# Altium schematic sheet ee453_pcb_Schulz.SchDoc: EE 453 Capstone
size B; ApprovedBy: Your Name; CheckedBy: Your Name; Author: Your Name; CompanyName: Dept. of Elec. and Comp. Engg.; DrawnBy: Your Name; Engineer: Your Nmae; Organization: UW-Seattle; Address1: 185 Stevens Way; Address2: Paul Allen Center; Address3: Seattle, WA; Address4: US-98195; DocumentNumber: 1; Revision: 1.0; SheetNumber: 1; SheetTotal: 1
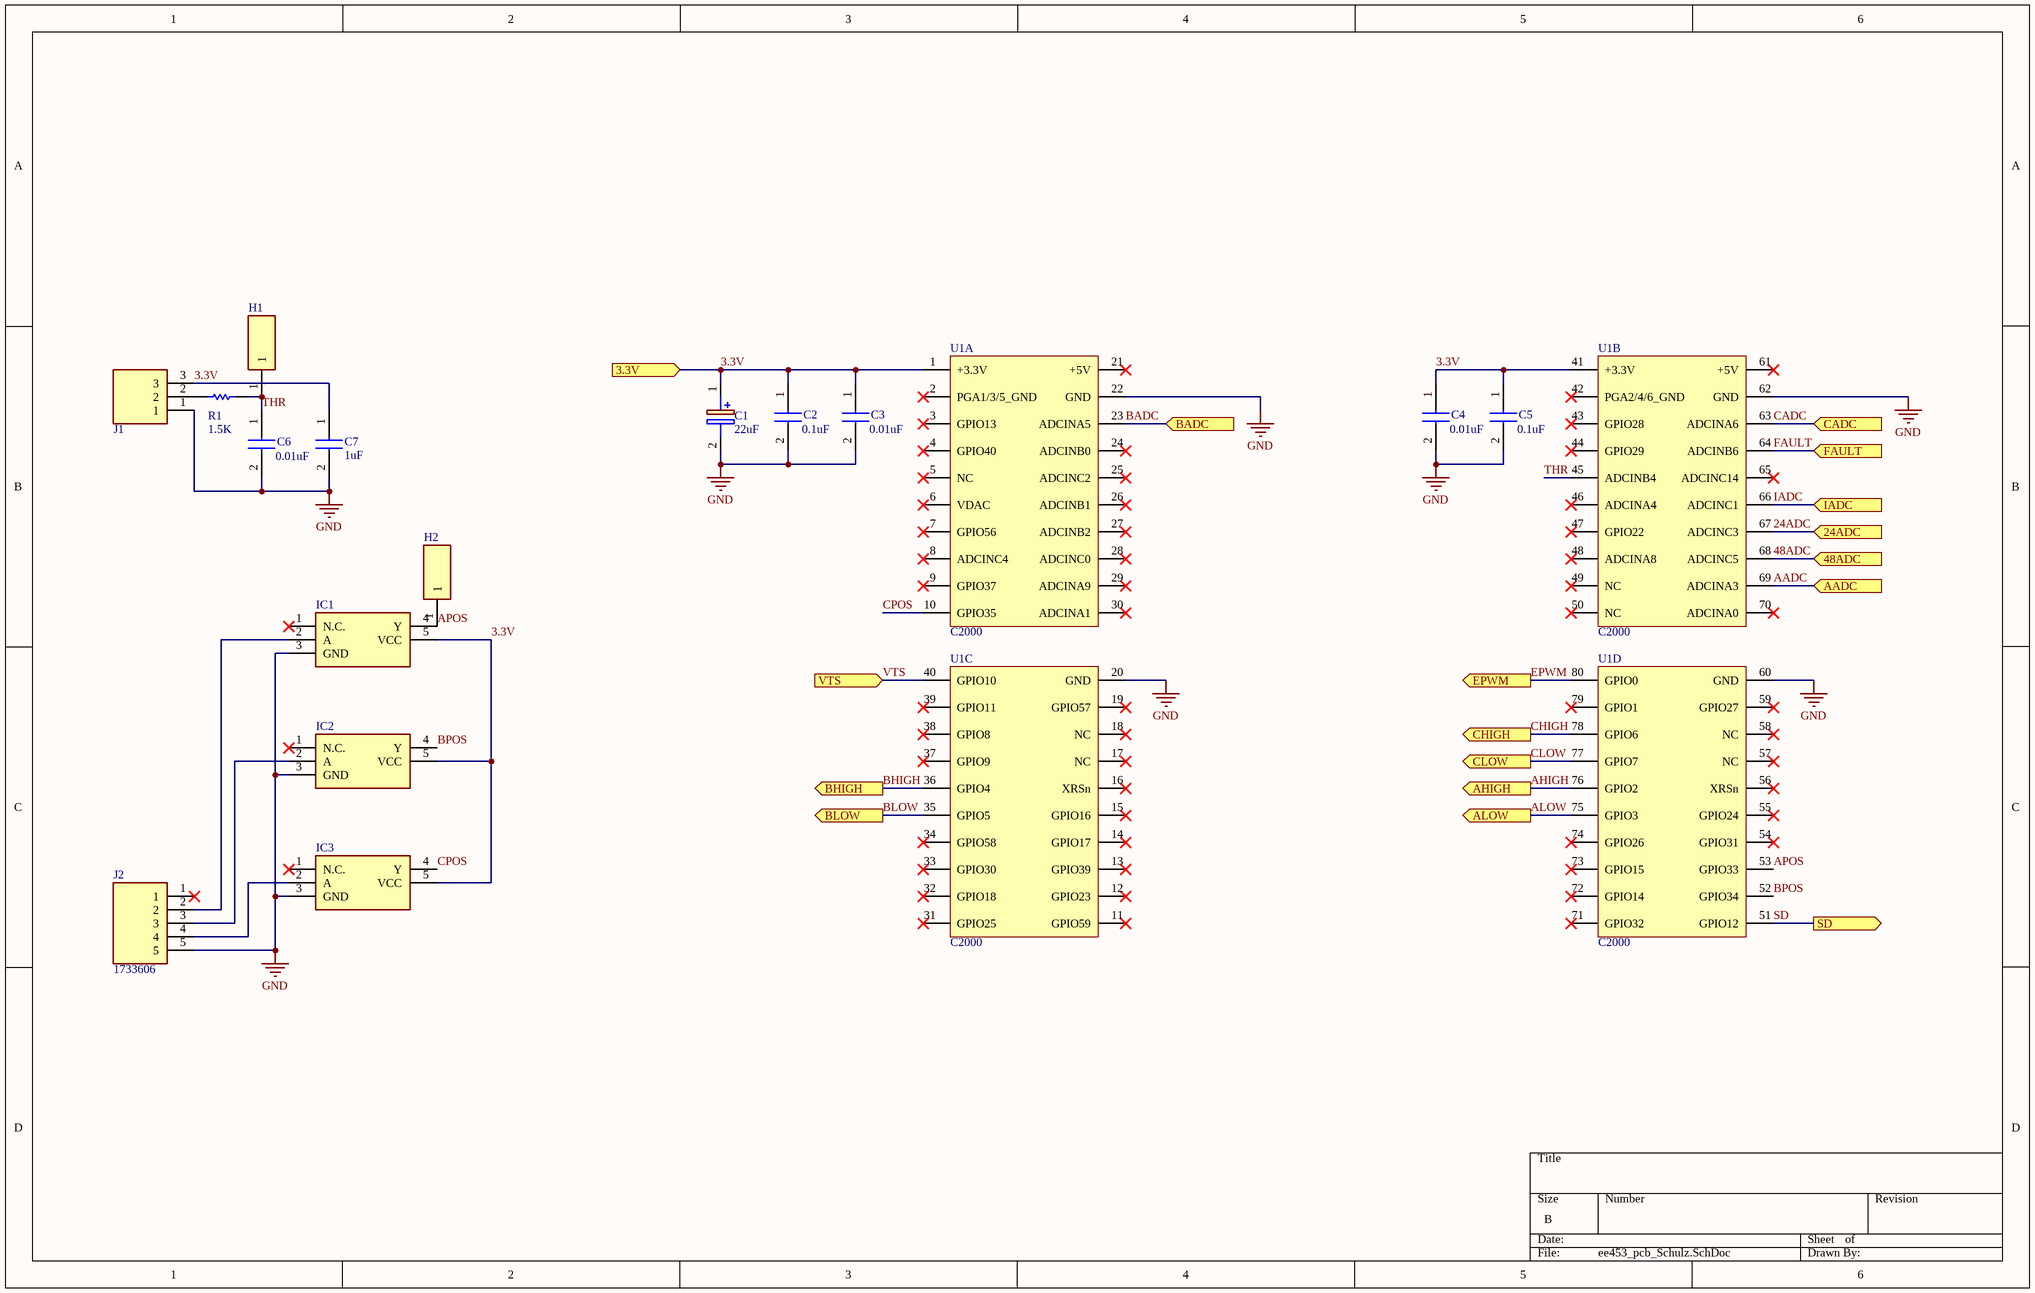
[diagram p0: ee453_pcb_Schulz.SchDoc]

## Parts
C1  value 22uF  [CAPPRD250W50D800H800]  (hidden comment: ECE-A1AKA220I)
C2  value 0.1uF  [CAPC1005X55N]  (hidden comment: CC0402KRX7R6BB104)
C3  value 0.01uF  [CAPC0603X33N]  (hidden comment: GRM033R71A103KA01D)
C4  value 0.01uF  [CAPC0603X33N]  (hidden comment: GRM033R71A103KA01D)
C5  value 0.1uF  [CAPC1005X55N]  (hidden comment: CC0402KRX7R6BB104)
C6  value 0.01uF  [C315C103K5R5TA7990]  (hidden comment: C315C103K5R5TA7990)
C7  value 1uF  [C330C105K5R5TA]  (hidden comment: C330C105K5R5TA)
H1  5003  [5003]  (value not drawn)
H2  5003  [5003]  (value not drawn)
IC1  SN74LV1T34DBVRG4  [SOT95P280X145-5N]  (value not drawn)
IC2  SN74LV1T34DBVRG4  [SOT95P280X145-5N]  (value not drawn)
IC3  SN74LV1T34DBVRG4  [SOT95P280X145-5N]  (value not drawn)
J1  1985917  [1985917]  (value not drawn)
J2  1733606  [SHDR5W110P0X500_1X5_2532X7360X1530P]
R1  value 1.5K  [AXIAL-0.3]  (hidden comment: Res1)
U1  C2000  [C2000]  (parts A,B,C,D of 4)

## Ports
3.3V (in), 24ADC (in), 48ADC (in), AADC (in), AHIGH (out), ALOW (out), BADC (in), BHIGH (out), BLOW (out), CADC (in), CHIGH (out), CLOW (out), EPWM (out), FAULT (in), IADC (in), SD (out), VTS (in)

## Nets
GND: C1.2(-) C2.2 C3.2 C4.2 C5.2 C6.2 C7.2 IC1.3(GND) IC2.3(GND) IC3.3(GND) J1.1 J2.5 U1.20(GND) U1.22(GND) U1.60(GND) U1.62(GND)
3.3V: C1.1(+) C2.1 C3.1 C4.1 C5.1 C7.1 IC1.5(VCC) IC2.5(VCC) IC3.5(VCC) J1.3 U1.1(+3.3V) U1.41(+3.3V) ; port 3.3V
24ADC: U1.67(ADCINC3) ; port 24ADC
48ADC: U1.68(ADCINC5) ; port 48ADC
AADC: U1.69(ADCINA3) ; port AADC
AHIGH: U1.76(GPIO2) ; port AHIGH
ALOW: U1.75(GPIO3) ; port ALOW
APOS: H2.1 IC1.4(Y) U1.53(GPIO33)
BADC: U1.23(ADCINA5) ; port BADC
BHIGH: U1.36(GPIO4) ; port BHIGH
BLOW: U1.35(GPIO5) ; port BLOW
BPOS: IC2.4(Y) U1.52(GPIO34)
CADC: U1.63(ADCINA6) ; port CADC
CHIGH: U1.78(GPIO6) ; port CHIGH
CLOW: U1.77(GPIO7) ; port CLOW
CPOS: IC3.4(Y) U1.10(GPIO35)
EPWM: U1.80(GPIO0) ; port EPWM
FAULT: U1.64(ADCINB6) ; port FAULT
IADC: U1.66(ADCINC1) ; port IADC
SD: U1.51(GPIO12) ; port SD
THR: C6.1 H1.1 R1.1 U1.45(ADCINB4)
VTS: U1.40(GPIO10) ; port VTS
NetIC1_2: IC1.2(A) J2.2
NetIC2_2: IC2.2(A) J2.3
NetIC3_2: IC3.2(A) J2.4
NetJ1_2: J1.2 R1.2

Not connected (* = marked no-connect by the designer): IC1 1(N.C.)*; IC2 1(N.C.)*; IC3 1(N.C.)*; J2 1*; U1 2(PGA1/3/5_GND)* 3(GPIO13)* 4(GPIO40)* 5(NC)* 6(VDAC)* 7(GPIO56)* 8(ADCINC4)* 9(GPIO37)* 11(GPIO59)* 12(GPIO23)* 13(GPIO39)* 14(GPIO17)* 15(GPIO16)* 16(XRSn)* 17(NC)* 18(NC)* 19(GPIO57)* 21(+5V)* 24(ADCINB0)* 25(ADCINC2)* 26(ADCINB1)* 27(ADCINB2)* 28(ADCINC0)* 29(ADCINA9)* 30(ADCINA1)* 31(GPIO25)* 32(GPIO18)* 33(GPIO30)* 34(GPIO58)* 37(GPIO9)* 38(GPIO8)* 39(GPIO11)* 42(PGA2/4/6_GND)* 43(GPIO28)* 44(GPIO29)* 46(ADCINA4)* 47(GPIO22)* 48(ADCINA8)* 49(NC)* 50(NC)* 54(GPIO31)* 55(GPIO24)* 56(XRSn)* 57(NC)* 58(NC)* 59(GPIO27)* 61(+5V)* 65(ADCINC14)* 70(ADCINA0)* 71(GPIO32)* 72(GPIO14)* 73(GPIO15)* 74(GPIO26)* 79(GPIO1)*

## Notes on the sheet
- Title
- Size:
- Date:
- B
- Number:
- Time:
- Revision:
- Sheet
- of
- File:

## Library data of the parts
C1 = ECE-A1AKA220I: Capacitor Polarised 10V; Manufacturer_Name: Panasonic; Datasheet Link: https://componentsearchengine.com/Datasheets/1/ECE-A1AKA220I.pdf; Height: 8mm; Manufacturer_Part_Number: ECE-A1AKA220I; Mouser Part Number: 667-ECE-A1AKA220I; Mouser Price/Stock: https://www.mouser.com/Search/Refine.aspx?Keyword=667-ECE-A1AKA220I
C2 C5 = CC0402KRX7R6BB104: Capacitor 10V; Manufacturer_Name: YAGEO (PHYCOMP); Datasheet Link: https://www.mouser.com/datasheet/2/447/UPY-GPHC_X7R_6.3V-to-50V_18-1154002.pdf; Height: 0.55mm; Manufacturer_Part_Number: CC0402KRX7R6BB104; Mouser Part Number: 603-CC402KRX7R6BB104; Mouser Price/Stock: https://www.mouser.com/Search/Refine.aspx?Keyword=603-CC402KRX7R6BB104; RS Part Number: 6698690; RS Price/Stock: http://uk.rs-online.com/web/p/products/6698690
C3 C4 = GRM033R71A103KA01D: Capacitor 10V; Manufacturer_Name: Murata Electronics; Datasheet Link: https://psearch.en.murata.com/capacitor/product/GRM033R71A103KA01%23.html; Height: 0.33mm; Manufacturer_Part_Number: GRM033R71A103KA01D; Mouser Part Number: 81-GRM033R71A103KA1D; Mouser Price/Stock: https://www.mouser.com/Search/Refine.aspx?Keyword=81-GRM033R71A103KA1D; RS Part Number: 7235143P; RS Price/Stock: http://uk.rs-online.com/web/p/products/7235143P
C6 = C315C103K5R5TA7990: Capacitor 50V; Manufacturer_Name: Kemet; Datasheet Link: https://api.kemet.com/component-edge/download/datasheet/C315C103K5R5TA.pdf; Height: 4.66mm; Manufacturer_Part_Number: C315C103K5R5TA7990; Mouser Part Number: N/A; Mouser Price/Stock: https://www.mouser.com/Search/Refine.aspx?Keyword=N%2FA
C7 = C330C105K5R5TA: Capacitor 50V; Manufacturer_Name: Kemet; Datasheet Link: http://uk.rs-online.com/web/p/products/8704038; Height: 9mm; Manufacturer_Part_Number: C330C105K5R5TA; Mouser Part Number: 80-C330C105K5R; Mouser Price/Stock: https://www.mouser.com/Search/Refine.aspx?Keyword=80-C330C105K5R; RS Part Number: 8704038; RS Price/Stock: http://uk.rs-online.com/web/p/products/8704038
H1 H2 = 5003: Hardware; Manufacturer_Name: Keystone Electronics; Allied_Number: 70799414; Datasheet Link: https://componentsearchengine.com/Datasheets/1/5003.pdf; Height: 4.57mm; Manufacturer_Part_Number: 5003; Mouser Part Number: 534-5003; Mouser Price/Stock: https://www.mouser.com/Search/Refine.aspx?Keyword=534-5003; Allied Price/Stock: https://www.alliedelec.com/keystoneelectronics-5003/70799414/
IC1-IC3 = SN74LV1T34DBVRG4: Integrated Circuit; Manufacturer_Name: Texas Instruments; Datasheet Link: http://www.ti.com/lit/gpn/sn74lv1t34; Height: 1.45mm; Manufacturer_Part_Number: SN74LV1T34DBVRG4; Mouser Part Number: 595-SN74LV1T34DBVRG4; Mouser Price/Stock: https://www.mouser.com/Search/Refine.aspx?Keyword=595-SN74LV1T34DBVRG4
J1 = 1985917: Connector; Manufacturer_Name: Phoenix Contact; Allied_Number: 70353658; Datasheet Link: https://media.digikey.com/pdf/Data%20Sheets/Phoenix%20Contact%20PDFs/Multi-Postion%20PCTerminal%20Blocks.pdf; Height: 13.95mm; Manufacturer_Part_Number: 1985917; Mouser Part Number: 651-1985917; Mouser Price/Stock: https://www.mouser.com/Search/Refine.aspx?Keyword=651-1985917; RS Part Number: 8552938; RS Price/Stock: http://uk.rs-online.com/web/p/products/8552938; Allied Price/Stock: https://www.alliedelec.com/phoenixcontact-1985917/70353658/
J2 = 1733606: Connector; Manufacturer_Name: Phoenix Contact; Datasheet Link: https://www.phoenixcontact.com/online/portal/gb/?uri=pxc-oc-itemdetail:pid=1733606&library=gben&pcck=P-11-01-05&tab=1&selectedCategory=ALL; Height: 15.3mm; Manufacturer_Part_Number: 1733606; Mouser Part Number: 651-1733606; Mouser Price/Stock: https://www.mouser.com/Search/Refine.aspx?Keyword=651-1733606; RS Part Number: 8818799; RS Price/Stock: https://uk.rs-online.com/web/p/products/8818799
R1 = Res1: Resistor; Published: 8-Jun-2000; LatestRevisionDate: 17-Jul-2002; LatestRevisionNote: Re-released for DXP Platform.; PackageReference: AXIAL-0.3; Publisher: Altium Limited; PackageDescription: Axial Device, Thru-Hole; 2 Leads; 0.3 in Pin Spacing
U1 = C2000: F280049C; Parameter 1: test 2